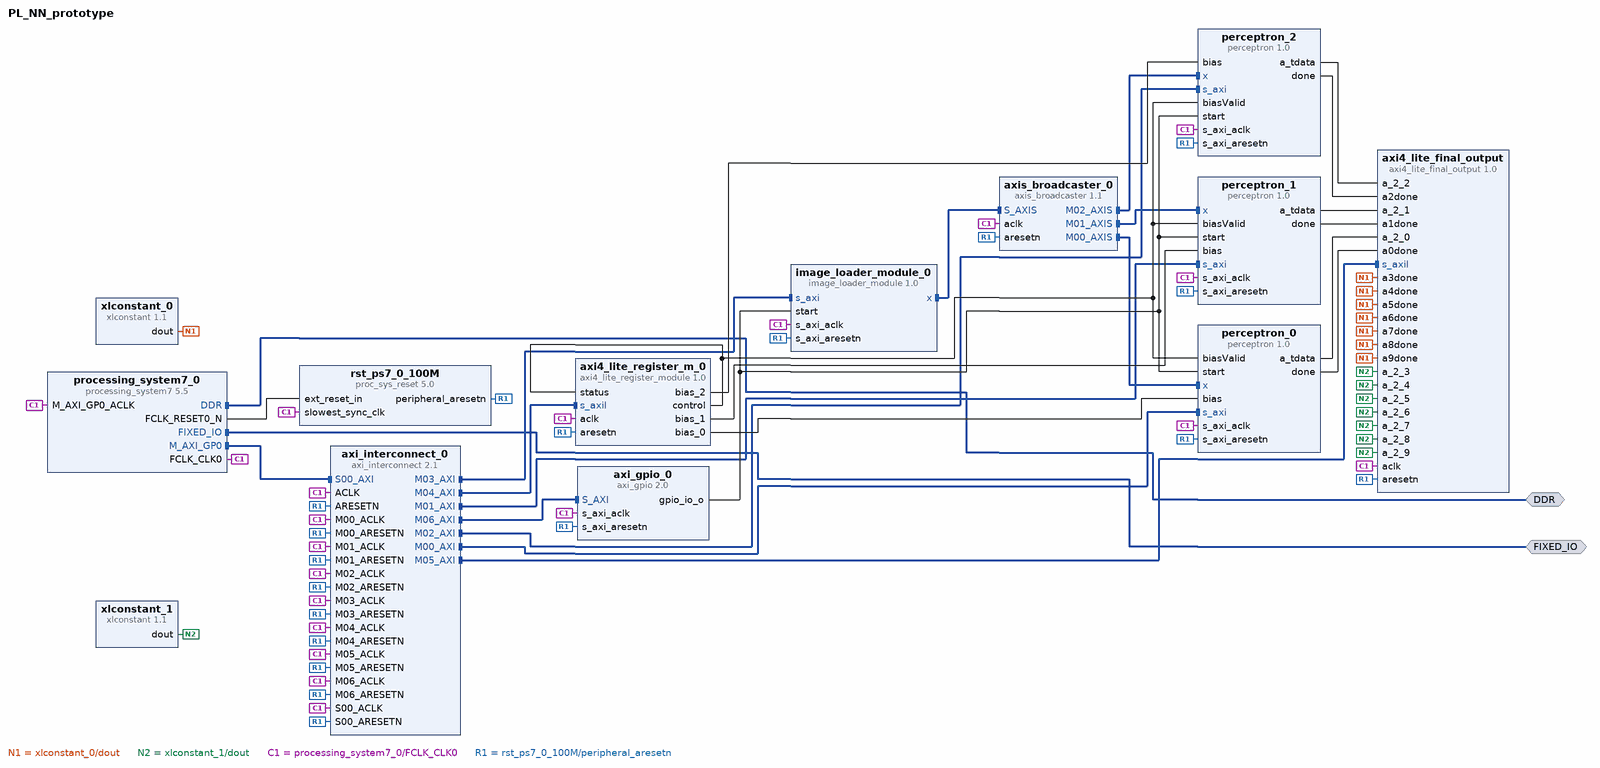
[diagram p0: block diagram of the top level]
# Vivado block design PL_NN_prototype, xc7z010clg400-1, Vivado 2019.2
create_bd_design PL_NN_prototype

create_bd_intf_port -mode Master -vlnv xilinx.com:interface:ddrx_rtl:1.0 DDR
create_bd_intf_port -mode Master -vlnv xilinx.com:display_processing_system7:fixedio_rtl:1.0 FIXED_IO

create_bd_cell -type ip -vlnv xilinx.com:ip:axi_interconnect:2.1 axi_interconnect_0
set_property -dict {CONFIG.NUM_MI 7} [get_bd_cells axi_interconnect_0]
create_bd_cell -type ip -vlnv xilinx.com:ip:axis_broadcaster:1.1 axis_broadcaster_0
set_property -dict [list \
  CONFIG.M02_TDATA_REMAP {tdata[31:0]} \
  CONFIG.M03_TDATA_REMAP {tdata[31:0]} \
  CONFIG.NUM_MI 3 \
] [get_bd_cells axis_broadcaster_0]
create_bd_cell -type ip -vlnv xilinx.com:user:image_loader_module:1.0 image_loader_module_0
create_bd_cell -type ip -vlnv xilinx.com:user:perceptron:1.0 perceptron_0
create_bd_cell -type ip -vlnv xilinx.com:user:perceptron:1.0 perceptron_1
create_bd_cell -type ip -vlnv xilinx.com:user:perceptron:1.0 perceptron_2
create_bd_cell -type ip -vlnv xilinx.com:ip:xlconstant:1.1 xlconstant_0
create_bd_cell -type ip -vlnv xilinx.com:ip:xlconstant:1.1 xlconstant_1
set_property -dict {CONFIG.CONST_VAL 0 CONFIG.CONST_WIDTH 32} [get_bd_cells xlconstant_1]
create_bd_cell -type ip -vlnv xilinx.com:ip:processing_system7:5.5 processing_system7_0
set_property -dict [list \
  CONFIG.PCW_APU_PERIPHERAL_FREQMHZ 650 \
  CONFIG.PCW_CRYSTAL_PERIPHERAL_FREQMHZ 50.000000 \
  CONFIG.PCW_ENET0_PERIPHERAL_ENABLE 0 \
  CONFIG.PCW_ENET0_RESET_ENABLE 0 \
  CONFIG.PCW_ENET_RESET_ENABLE 1 \
  CONFIG.PCW_FPGA0_PERIPHERAL_FREQMHZ 100 \
  CONFIG.PCW_FPGA1_PERIPHERAL_FREQMHZ 50 \
  CONFIG.PCW_GP0_EN_MODIFIABLE_TXN 0 \
  CONFIG.PCW_GP1_EN_MODIFIABLE_TXN 0 \
  CONFIG.PCW_GPIO_MIO_GPIO_ENABLE 1 \
  CONFIG.PCW_GPIO_MIO_GPIO_IO MIO \
  CONFIG.PCW_I2C_RESET_ENABLE 1 \
  CONFIG.PCW_PERIPHERAL_BOARD_PRESET part0 \
  CONFIG.PCW_PRESET_BANK1_VOLTAGE {LVCMOS 1.8V} \
  CONFIG.PCW_QSPI_GRP_FBCLK_ENABLE 1 \
  CONFIG.PCW_QSPI_GRP_FBCLK_IO {MIO 8} \
  CONFIG.PCW_QSPI_GRP_SINGLE_SS_ENABLE 1 \
  CONFIG.PCW_QSPI_GRP_SINGLE_SS_IO {MIO 1 .. 6} \
  CONFIG.PCW_QSPI_PERIPHERAL_ENABLE 1 \
  CONFIG.PCW_QSPI_QSPI_IO {MIO 1 .. 6} \
  CONFIG.PCW_SD0_PERIPHERAL_ENABLE 0 \
  CONFIG.PCW_SDIO_PERIPHERAL_FREQMHZ 50 \
  CONFIG.PCW_SINGLE_QSPI_DATA_MODE x4 \
  CONFIG.PCW_UART1_PERIPHERAL_ENABLE 0 \
  CONFIG.PCW_UART_PERIPHERAL_FREQMHZ 100 \
  CONFIG.PCW_UIPARAM_DDR_FREQ_MHZ 525 \
  CONFIG.PCW_UIPARAM_DDR_PARTNO {MT41K128M16 JT-125} \
  CONFIG.PCW_USB0_PERIPHERAL_ENABLE 0 \
  CONFIG.PCW_USB0_RESET_ENABLE 1 \
  CONFIG.PCW_USB0_RESET_IO {MIO 46} \
  CONFIG.PCW_USB_RESET_ENABLE 1 \
] [get_bd_cells processing_system7_0]
# 486 more settings of processing_system7_0 are not shown: defaults, MIO pin electricals, DDR timing, and values the tool derives
create_bd_cell -type ip -vlnv xilinx.com:ip:axi_gpio:2.0 axi_gpio_0
set_property -dict {CONFIG.C_ALL_INPUTS 0 CONFIG.C_ALL_OUTPUTS 1 CONFIG.C_GPIO_WIDTH 1} [get_bd_cells axi_gpio_0]
create_bd_cell -type ip -vlnv xilinx.com:ip:proc_sys_reset:5.0 rst_ps7_0_100M
create_bd_cell -type ip -vlnv xilinx.com:user:axi4_lite_final_output:1.0 axi4_lite_final_output
create_bd_cell -type ip -vlnv xilinx.com:user:axi4_lite_register_module:1.0 axi4_lite_register_m_0

# ---- connections ----

connect_bd_intf_net [get_bd_intf_pins processing_system7_0/M_AXI_GP0] [get_bd_intf_pins axi_interconnect_0/S00_AXI]
connect_bd_intf_net [get_bd_intf_pins image_loader_module_0/s_axi] [get_bd_intf_pins axi_interconnect_0/M03_AXI]
connect_bd_intf_net [get_bd_intf_pins axis_broadcaster_0/M01_AXIS] [get_bd_intf_pins perceptron_1/x]
connect_bd_intf_net [get_bd_intf_pins axi_interconnect_0/M01_AXI] [get_bd_intf_pins perceptron_1/s_axi]
connect_bd_intf_net [get_bd_intf_pins axi_interconnect_0/M04_AXI] [get_bd_intf_pins axi4_lite_register_m_0/s_axil]
connect_bd_intf_net [get_bd_intf_pins axi_interconnect_0/M00_AXI] [get_bd_intf_pins perceptron_0/s_axi]
connect_bd_intf_net [get_bd_intf_pins axi_interconnect_0/M02_AXI] [get_bd_intf_pins perceptron_2/s_axi]
connect_bd_intf_net [get_bd_intf_pins axis_broadcaster_0/M00_AXIS] [get_bd_intf_pins perceptron_0/x]
connect_bd_intf_net [get_bd_intf_ports DDR] [get_bd_intf_pins processing_system7_0/DDR]
connect_bd_intf_net [get_bd_intf_pins axis_broadcaster_0/M02_AXIS] [get_bd_intf_pins perceptron_2/x]
connect_bd_intf_net [get_bd_intf_pins image_loader_module_0/x] [get_bd_intf_pins axis_broadcaster_0/S_AXIS]
connect_bd_intf_net [get_bd_intf_ports FIXED_IO] [get_bd_intf_pins processing_system7_0/FIXED_IO]
connect_bd_intf_net [get_bd_intf_pins axi_interconnect_0/M06_AXI] [get_bd_intf_pins axi_gpio_0/S_AXI]
connect_bd_intf_net [get_bd_intf_pins axi4_lite_final_output/s_axil] [get_bd_intf_pins axi_interconnect_0/M05_AXI]
connect_bd_net [get_bd_pins axi4_lite_register_m_0/bias_0] [get_bd_pins perceptron_0/bias]
connect_bd_net [get_bd_pins axi4_lite_register_m_0/bias_1] [get_bd_pins perceptron_1/bias]
connect_bd_net [get_bd_pins axi4_lite_register_m_0/bias_2] [get_bd_pins perceptron_2/bias]
connect_bd_net [get_bd_pins axi4_lite_register_m_0/control] \
  [get_bd_pins perceptron_0/biasValid] [get_bd_pins perceptron_1/biasValid] [get_bd_pins perceptron_2/biasValid] \
  [get_bd_pins axi4_lite_register_m_0/status]
connect_bd_net -net start_0_1 [get_bd_pins axi_gpio_0/gpio_io_o] \
  [get_bd_pins image_loader_module_0/start] [get_bd_pins perceptron_0/start] [get_bd_pins perceptron_1/start] \
  [get_bd_pins perceptron_2/start]
connect_bd_net [get_bd_pins perceptron_0/a_tdata] [get_bd_pins axi4_lite_final_output/a_2_0]
connect_bd_net [get_bd_pins perceptron_1/a_tdata] [get_bd_pins axi4_lite_final_output/a_2_1]
connect_bd_net [get_bd_pins perceptron_2/a_tdata] [get_bd_pins axi4_lite_final_output/a_2_2]
connect_bd_net [get_bd_pins perceptron_2/done] [get_bd_pins axi4_lite_final_output/a2done]
connect_bd_net [get_bd_pins perceptron_1/done] [get_bd_pins axi4_lite_final_output/a1done]
connect_bd_net [get_bd_pins perceptron_0/done] [get_bd_pins axi4_lite_final_output/a0done]
connect_bd_net [get_bd_pins xlconstant_0/dout] \
  [get_bd_pins axi4_lite_final_output/a3done] [get_bd_pins axi4_lite_final_output/a4done] \
  [get_bd_pins axi4_lite_final_output/a5done] [get_bd_pins axi4_lite_final_output/a6done] \
  [get_bd_pins axi4_lite_final_output/a7done] [get_bd_pins axi4_lite_final_output/a8done] \
  [get_bd_pins axi4_lite_final_output/a9done]
connect_bd_net [get_bd_pins xlconstant_1/dout] \
  [get_bd_pins axi4_lite_final_output/a_2_3] [get_bd_pins axi4_lite_final_output/a_2_4] \
  [get_bd_pins axi4_lite_final_output/a_2_5] [get_bd_pins axi4_lite_final_output/a_2_6] \
  [get_bd_pins axi4_lite_final_output/a_2_7] [get_bd_pins axi4_lite_final_output/a_2_8] \
  [get_bd_pins axi4_lite_final_output/a_2_9]
connect_bd_net [get_bd_pins processing_system7_0/FCLK_CLK0] \
  [get_bd_pins processing_system7_0/M_AXI_GP0_ACLK] [get_bd_pins axi_interconnect_0/ACLK] \
  [get_bd_pins axi_interconnect_0/S00_ACLK] [get_bd_pins axi_interconnect_0/M00_ACLK] \
  [get_bd_pins axi_interconnect_0/M01_ACLK] [get_bd_pins axi_interconnect_0/M02_ACLK] \
  [get_bd_pins axi_interconnect_0/M03_ACLK] [get_bd_pins axi_interconnect_0/M04_ACLK] [get_bd_pins axis_broadcaster_0/aclk] \
  [get_bd_pins image_loader_module_0/s_axi_aclk] [get_bd_pins perceptron_0/s_axi_aclk] [get_bd_pins perceptron_1/s_axi_aclk] \
  [get_bd_pins perceptron_2/s_axi_aclk] [get_bd_pins axi_interconnect_0/M05_ACLK] [get_bd_pins axi_gpio_0/s_axi_aclk] \
  [get_bd_pins axi_interconnect_0/M06_ACLK] [get_bd_pins rst_ps7_0_100M/slowest_sync_clk] \
  [get_bd_pins axi4_lite_final_output/aclk] [get_bd_pins axi4_lite_register_m_0/aclk]
connect_bd_net [get_bd_pins processing_system7_0/FCLK_RESET0_N] [get_bd_pins rst_ps7_0_100M/ext_reset_in]
connect_bd_net [get_bd_pins rst_ps7_0_100M/peripheral_aresetn] \
  [get_bd_pins axi_interconnect_0/ARESETN] [get_bd_pins axi_interconnect_0/S00_ARESETN] \
  [get_bd_pins axi_interconnect_0/M00_ARESETN] [get_bd_pins axi_interconnect_0/M01_ARESETN] \
  [get_bd_pins axi_interconnect_0/M02_ARESETN] [get_bd_pins axi_interconnect_0/M03_ARESETN] \
  [get_bd_pins axi_interconnect_0/M04_ARESETN] [get_bd_pins axis_broadcaster_0/aresetn] \
  [get_bd_pins image_loader_module_0/s_axi_aresetn] [get_bd_pins perceptron_0/s_axi_aresetn] \
  [get_bd_pins perceptron_1/s_axi_aresetn] [get_bd_pins perceptron_2/s_axi_aresetn] \
  [get_bd_pins axi_interconnect_0/M05_ARESETN] [get_bd_pins axi_interconnect_0/M06_ARESETN] \
  [get_bd_pins axi_gpio_0/s_axi_aresetn] [get_bd_pins axi4_lite_final_output/aresetn] \
  [get_bd_pins axi4_lite_register_m_0/aresetn]

# ---- address map ----
assign_bd_address -offset 0x40000000 -range 4K -target_address_space [get_bd_addr_spaces processing_system7_0/Data] [get_bd_addr_segs perceptron_0/s_axi/reg0]
assign_bd_address -offset 0x40001000 -range 4K -target_address_space [get_bd_addr_spaces processing_system7_0/Data] [get_bd_addr_segs perceptron_1/s_axi/reg0]
assign_bd_address -offset 0x40002000 -range 4K -target_address_space [get_bd_addr_spaces processing_system7_0/Data] [get_bd_addr_segs perceptron_2/s_axi/reg0]
assign_bd_address -offset 0x41200000 -range 128 -target_address_space [get_bd_addr_spaces processing_system7_0/Data] [get_bd_addr_segs axi_gpio_0/S_AXI/Reg]
assign_bd_address -offset 0x43000000 -range 4K -target_address_space [get_bd_addr_spaces processing_system7_0/Data] [get_bd_addr_segs axi4_lite_final_output/s_axil/reg0]
assign_bd_address -offset 0x50000000 -range 4K -target_address_space [get_bd_addr_spaces processing_system7_0/Data] [get_bd_addr_segs image_loader_module_0/S_AXI/reg0]
assign_bd_address -offset 0x60000000 -range 4K -target_address_space [get_bd_addr_spaces processing_system7_0/Data] [get_bd_addr_segs axi4_lite_register_m_0/s_axil/reg0]

validate_bd_design
save_bd_design
